# EasyEDA Pro project 第十五届蓝桥杯EDA赛项模拟试题一（嘉立创EDA提供）.eprj

# Schematic Schematic1
Create Date: 2024-01-25; Page Name: P1; Project Name: 第十五届蓝桥杯EDA赛项模拟试题一（嘉立创EDA提供）; Schematic Name: Schematic1; Update Date: 2024-01-25; Company: 深圳嘉立创科技集团股份有限公司; Drawed: 嘉立创EDA; Page Size: A4; Part Number: JLC-PCB-002; Reviewed: 嘉立创EDA; Version: V1.0
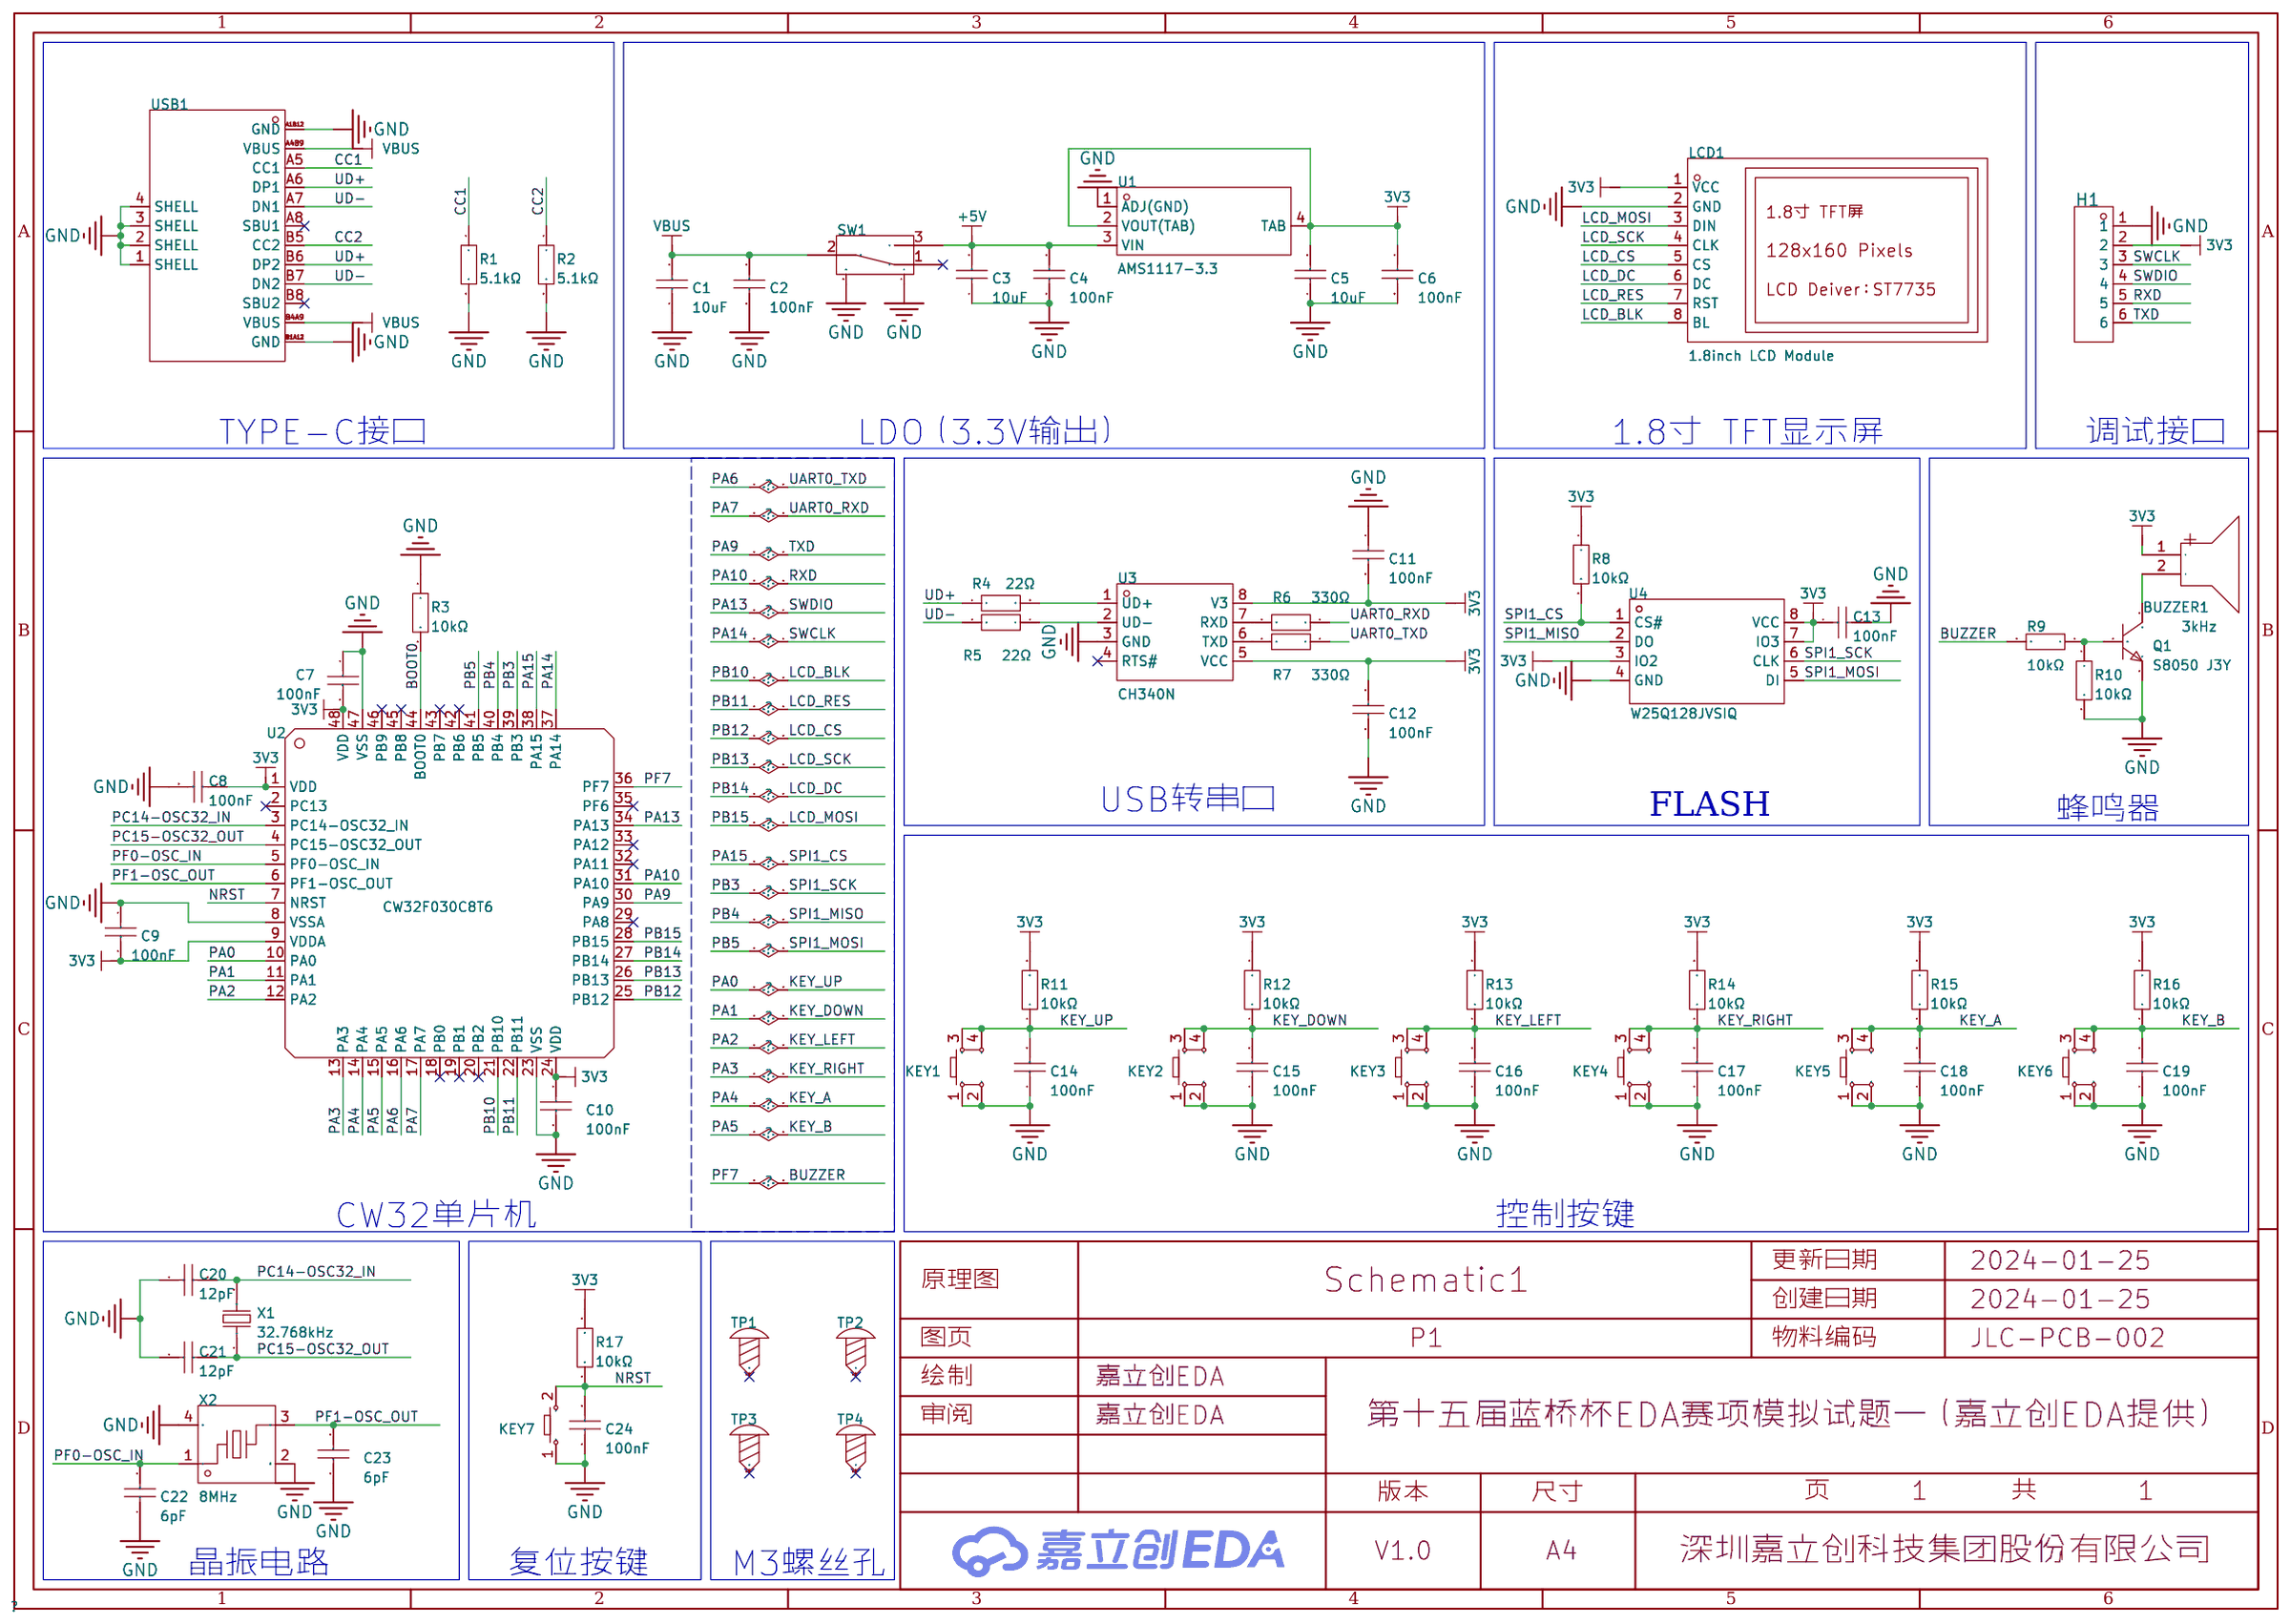
[diagram p0: schematic sheet]

## Parts
BUZZER1  3kHz  [BUZ-TH_BD9.0-P5.00-D0.6-FD]
C1  10uF  [C0805]
C2  100nF  [C0805]
C3  10uF  [C0805]
C4  100nF  [C0805]
C5  10uF  [C0805]
C6  100nF  [C0805]
C7  100nF  [C0805]
C8  100nF  [C0805]
C9  100nF  [C0805]
C10  100nF  [C0805]
C11  100nF  [C0805]
C12  100nF  [C0805]
C13  100nF  [C0805]
C14  100nF  [C0805]
C15  100nF  [C0805]
C16  100nF  [C0805]
C17  100nF  [C0805]
C18  100nF  [C0805]
C19  100nF  [C0805]
C20  12pF  [C0805]
C21  12pF  [C0805]
C22  6pF  [C0805]
C23  6pF  [C0805]
C24  100nF  [C0805]
H1  PZ254V-11-06P  [HDR-TH_6P-P2.54-V-M]
KEY1  -  [SW-SMD_4P-L6.0-W6.0-P4.50-LS9.0-2]
KEY2  -  [SW-SMD_4P-L6.0-W6.0-P4.50-LS9.0-2]
KEY3  -  [SW-SMD_4P-L6.0-W6.0-P4.50-LS9.0-2]
KEY4  -  [SW-SMD_4P-L6.0-W6.0-P4.50-LS9.0-2]
KEY5  -  [SW-SMD_4P-L6.0-W6.0-P4.50-LS9.0-2]
KEY6  -  [SW-SMD_4P-L6.0-W6.0-P4.50-LS9.0-2]
KEY7  -  [Key_SMD_3.6x6.1x2.5]
LCD1  1.8inch LCD Module  [LCD-TH_L56.5-W34.0_1-8INCH-LCD-MODULE]
Q1  S8050 J3Y  [SOT-23-3_L3.0-W1.7-P0.95-LS2.9-BR]
R1  5.1kΩ  [R0805]
R2  5.1kΩ  [R0805]
R3  10kΩ  [R0805]
R4  22Ω  [R0805]
R5  22Ω  [R0805]
R6  330Ω  [R0805]
R7  330Ω  [R0805]
R8  10kΩ  [R0805]
R9  10kΩ  [R0805]
R10  10kΩ  [R0805]
R11  10kΩ  [R0805]
R12  10kΩ  [R0805]
R13  10kΩ  [R0805]
R14  10kΩ  [R0805]
R15  10kΩ  [R0805]
R16  10kΩ  [R0805]
R17  10kΩ  [R0805]
SW1  SK-12E12-G5  [SW-TH_SK-12E12-G5]
TP1  -  [M3螺丝]
TP2  -  [M3螺丝]
TP3  -  [M3螺丝]
TP4  -  [M3螺丝]
U1  AMS1117-3.3  [SOT-223-4_L6.5-W3.5-P2.30-LS7.0-BR]
U2  CW32F030C8T6  [LQ-LQFP48]
U3  CH340N  [SOP-8_L4.9-W3.9-P1.27-LS6.0-BL]
U4  W25Q128JVSIQ  [SOIC-8_L5.3-W5.3-P1.27-LS8.0-BL]
USB1  TYPE-C 16PIN 3MD(385)  [USB-C-SMD_TYPE-C16PIN]
X1  32.768kHz  [FC-135R_L3.2-W1.5]
X2  8MHz  [OSC-SMD_4P-L3.2-W2.5-BL]

## Library data of the parts
BUZZER1 = HNB09A03: 驱动方式:有源(内含驱动线路);构造类型:电磁式;额定电压:3V;工作电压:1.5V~4.5V;消耗电流:30mA;频率:3kHz;声压(SPL):85dB@10cm;直径(φD):9mm;长度:-;宽度:-;高度:5.5mm;工作温度:-20℃~+70℃;; LCSC Part Name: 电磁式有源一体蜂鸣器HNB09A03; Supplier Part: C96102; Manufacturer: 华能; Supplier Footprint: 插件,D=9mm; Datasheet: https://atta.szlcsc.com/upload/public/pdf/source/20170522/1495448326172.pdf; Supplier: LCSC; Oscillator Circuit: 有源(内含驱动线路); Technology Type: 电磁式; Rated Voltage: 3V; Operating Voltage: 1.5V~4.5V; Current Consumption: 30mA; Sound Pressure Level (SPL): 85dB@10cm; Diameter (φD): 9mm; Height: 5.5mm; Operating Temperature: -20℃~+70℃
C1 C3 C5 = CL21A106KAYNNNE_C15850: 容值:10uF;精度:±10%;额定电压:25V;材质(温度系数):X5R;; LCSC Part Name: 10uF ±10% 25V; Supplier Part: C15850; Manufacturer: SAMSUNG(三星); Manufacturer Part: CL21A106KAYNNNE; Supplier Footprint: 0805; Datasheet: https://atta.szlcsc.com/upload/public/pdf/source/20160103/1457707679302.pdf; Supplier: LCSC; Tolerance: ±10%; Voltage Rated: 25V; Temperature Coefficient: X5R
C2 C4 C6-C19 C24 = CL21B104KBCNNNC: 容值:100nF;精度:±10%;额定电压:50V;材质(温度系数):X7R;; LCSC Part Name: 100nF ±10% 50V; Supplier Part: C1711; Manufacturer: SAMSUNG(三星); Supplier Footprint: 0805; Datasheet: https://atta.szlcsc.com/upload/public/pdf/source/20160218/1457707763339.pdf; Supplier: LCSC; Tolerance: ±10%; Voltage Rated: 50V; Temperature Coefficient: X7R
C20 C21 = 0805CG120J500NT: 容值:12pF;精度:±5%;额定电压:50V;材质(温度系数):C0G;; LCSC Part Name: 12pF ±5% 50V; Supplier Part: C1792; Manufacturer: FH(风华); Supplier Footprint: 0805; Datasheet: https://atta.szlcsc.com/upload/public/pdf/source/20200305/C486355_26A10D38EF8C2A5C37091D0039909270.pdf; Supplier: LCSC; Tolerance: ±5%; Voltage Rated: 50V; Temperature Coefficient: C0G
C22 C23 = 0805CG6R0C500NT: 容值:6pF;额定电压:50V;材质(温度系数):C0G;; LCSC Part Name: 6pF 50V ±0.25pF; Supplier Part: C67560; Manufacturer: FH(风华); Supplier Footprint: 0805; JLCPCB Part Class: 扩展库; Datasheet: https://atta.szlcsc.com/upload/public/pdf/source/20200305/C486355_26A10D38EF8C2A5C37091D0039909270.pdf; Supplier: LCSC; Voltage Rated: 50V; Temperature Coefficient: C0G
H1 = PZ254V-11-06P: 排数:单排;总PIN位数:6;间距:2.54mm;插针结构:1x6P;行距:-;安装类型:直插;圆针/方针:方针;额定电流:-;额定电压:-;配合针长度:6mm;塑高:2.5mm;端接针长度:3mm;触头材质:黄铜;触头镀层:-;工作温度范围:-40℃~+105℃;颜色:黑色;; LCSC Part Name: 2.54mm 1x6P 直插 方针; Supplier Part: C492405; Manufacturer: XFCN(兴飞); Supplier Footprint: 直插,P=2.54mm; JLCPCB Part Class: 扩展库; Supplier: LCSC; Number of Rows: 单排; Number of Pins: 6; Pitch: 2.54mm; Pin Structure: 1x6P; Mounting Type: 直插; Circluar Pins/Square Pins: 方针; Length of Mating Pin: 6mm; Insulation Height: 2.5mm; Length of End Connection Pin: 3mm; Contact Material: 黄铜; Operating Temperature Range: -40℃~+105℃; Color: 黑色
KEY1-KEY6 = Key_SMD_6x6x6.5: Supplier Footprint: SMD
KEY7 = Key_SMD_3.6x6.1x2.5: Supplier Footprint: SMD
LCD1 = 1.8inch LCD Module: 主控芯片:ST7735S;尺寸(inch):1.8;; LCSC Part Name: 树莓派 1.8寸LCD 迷你显示屏 扩展板 SPI接口 支持Arduino; Supplier Part: C359940; Manufacturer: Waveshare(微雪电子); Datasheet: https://atta.szlcsc.com/upload/public/pdf/source/20190107/C359940_B08D95A5D16FFF3D67403C4EC320696B.pdf; Supplier: LCSC; Main Control Chip: ST7735S; Size: 1.8
Q1 = S8050 J3Y_C2146: 晶体管类型:NPN;集射极击穿电压(Vceo):25V;集电极电流(Ic):500mA;功率(Pd):300mW;直流电流增益(hFE@Ic,Vce):200@50mA,1V;; LCSC Part Name: NPN 25V 500mA (200-350); Supplier Part: C2146; Manufacturer: CJ(江苏长电/长晶); Supplier Footprint: SOT-23; Datasheet: https://atta.szlcsc.com/upload/public/pdf/source/20140809/1457707209234.pdf; Supplier: LCSC; Transistor Type: NPN; Collector-Emitter Breakdown Voltage (Vceo): 25V; Collector Current (Ic): 500mA; Power Dissipation (Pd): 300mW; Collector Cut-Off Current (Icbo): 100nA; Collector-Emitter Saturation Voltage (VCE(sat)@Ic,Ib): 600mV@500mA,50mA; DC Current Gain (hFE@Ic,Vce): 200@50mA,1V; Transition Frequency (fT): 150MHz; Operating Temperature: +150℃@(Tj)
R1 R2 = 0805W8F5101T5E: 阻值:5.1kΩ;精度:±1%;功率:125mW;温度系数:±100ppm/℃;电阻类型:厚膜电阻;; LCSC Part Name: 5.1kΩ ±1% 125mW 厚膜电阻; Supplier Part: C27834; Manufacturer: UNI-ROYAL(厚声); Supplier Footprint: 0805; JLCPCB Part Class: 基础库; Datasheet: https://atta.szlcsc.com/upload/public/pdf/source/20200306/C422600_1E6D84923E4A46A82E41ADD87F860B5C.pdf; Supplier: LCSC; Tolerance: ±1%; Power(Watts): 125mW; Overload Voltage (Max): 150V; Temperature Coefficient: ±100ppm/℃; Type: 厚膜电阻; Operating Temperature Range: -55℃~+155℃
R3 R8-R17 = 0805W8F1002T5E_C17414: 阻值:10kΩ;精度:±1%;功率:125mW;温度系数:±100ppm/℃;电阻类型:厚膜电阻;; LCSC Part Name: 10kΩ ±1% 125mW 厚膜电阻; Supplier Part: C17414; Manufacturer: UNI-ROYAL(厚声); Manufacturer Part: 0805W8F1002T5E; Supplier Footprint: 0805; Datasheet: https://atta.szlcsc.com/upload/public/pdf/source/20200306/C422600_1E6D84923E4A46A82E41ADD87F860B5C.pdf; Supplier: LCSC; Tolerance: ±1%; Power(Watts): 125mW; Overload Voltage (Max): 150V; Temperature Coefficient: ±100ppm/℃; Type: 厚膜电阻; Operating Temperature Range: -55℃~+155℃
R4 R5 = 0805W8F220JT5E: 阻值:22Ω;精度:±1%;功率:125mW;温度系数:±100ppm/℃;电阻类型:厚膜电阻;; LCSC Part Name: 22Ω ±1% 125mW 厚膜电阻; Supplier Part: C17561; Manufacturer: UNI-ROYAL(厚声); Supplier Footprint: 0805; JLCPCB Part Class: 基础库; Datasheet: https://atta.szlcsc.com/upload/public/pdf/source/20200306/C422600_1E6D84923E4A46A82E41ADD87F860B5C.pdf; Supplier: LCSC; Tolerance: ±1%; Power(Watts): 125mW; Overload Voltage (Max): 150V; Temperature Coefficient: ±100ppm/℃; Type: 厚膜电阻; Operating Temperature Range: -55℃~+155℃
R6 R7 = 0805W8F3300T5E: 阻值:330Ω;精度:±1%;功率:125mW;温度系数:±100ppm/℃;电阻类型:厚膜电阻;; LCSC Part Name: 330Ω ±1% 125mW 厚膜电阻; Supplier Part: C17630; Manufacturer: UNI-ROYAL(厚声); Supplier Footprint: 0805; JLCPCB Part Class: 基础库; Datasheet: https://atta.szlcsc.com/upload/public/pdf/source/20200306/C422600_1E6D84923E4A46A82E41ADD87F860B5C.pdf; Supplier: LCSC; Tolerance: ±1%; Power(Watts): 125mW; Overload Voltage (Max): 150V; Temperature Coefficient: ±100ppm/℃; Type: 厚膜电阻; Operating Temperature Range: -55℃~+155℃
SW1 = SK-12E12-G5: 额定电流(DC):-;额定电压(DC):-;额定电流(AC):-;额定电压(AC):-;电路结构:单刀双掷;安装方式:卧插;机械寿命:5千次;; LCSC Part Name: 卧插双档 滑动开关; Supplier Part: C136720; Manufacturer: 韩国韩荣; Supplier Footprint: 插件; JLCPCB Part Class: 扩展库; Datasheet: https://atta.szlcsc.com/upload/public/pdf/source/20210810/880D64C2F8CCE477762EFCC00B7B7681.pdf; Supplier: LCSC; Circuit: 单刀双掷; Mounting Style: 卧插; Mechanical Life: 5千次; Actuator Style: 矩形柱状; Pin Style: PC引脚; Operating Temperature: -25℃~+70℃; Switch Height: 10.6mm
TP1-TP4 = M3螺丝: Supplier Footprint: 插件
U1 = AMS1117-3.3_C347222: 输出类型:固定;最大输入电压:18V;输出电压:3.3V;输出电流:1A;电源纹波抑制比(PSRR):60dB@(120Hz);输出极性:正;; LCSC Part Name: 输入18V 输出3.3V 1A; Supplier Part: C347222; Manufacturer: UMW(友台半导体); Supplier Footprint: SOT-223; JLCPCB Part Class: 扩展库; Datasheet: https://atta.szlcsc.com/upload/public/pdf/source/20231109/155D79A26D9DB04352555A58D5969DC8.pdf; Supplier: LCSC; Output Type: 固定; Maximum Input Voltage: 18V; Output Voltage: 3.3V; Output Current: 1A; Power Supply Rejection Ratio (PSRR): 60dB@(120Hz); Dropout Voltage: 1.3V@(1A); Output Polarity: 正; Number of Outputs: 1
U2 = CW32F030C8T6_C3019113: CPU内核:ARM-M系列;CPU最大主频:64MHz;程序存储容量:-;程序存储器类型:-;GPIO端口数量:39;工作电压范围:1.65V~5.5V;RAM总容量:8KB;; Supplier Part: C3019113; Manufacturer: CW(芯源); Supplier Footprint: LQFP-48(7x7); Datasheet: https://atta.szlcsc.com/upload/public/pdf/source/20220516/D60F5E1023A73FFF550D4A77416DDFBC.pdf; Supplier: LCSC; CPU Core: ARM-M系列; CPU Maximum Speed: 64MHz; GPIO Ports Number: 39; Operating Voltage Range: 1.65V~5.5V; RAM Size: 8KB; Operating Temperature Range: -40℃~+105℃; ADC (Bit): 12bit; 16Bit Timer: 8; UART/USART: 3; I2C: 2; SPI: 2; Internal Comparator: 有; Peripheral/Function: 片载温度传感器；DMA；看门狗；低电压检测；CRC校验; Watchdog: 有; Low-Voltage Detect: 有; Direct Memory Access: 有
U3 = CH340N: LCSC Part Name: USB转串口芯片 CH340; Supplier Part: C2977777; Manufacturer: WCH(南京沁恒); Supplier Footprint: SOP-8; JLCPCB Part Class: 扩展库; Datasheet: https://atta.szlcsc.com/upload/public/pdf/source/20230530/6E401E9554E9F5311886CC8B3F89B62E.pdf; Supplier: LCSC
U4 = W25Q128JVSIQ: 接口类型:-;存储容量:128Mbit;时钟频率(fc):-;; LCSC Part Name: W25Q128JVSIQ 编带; Supplier Part: C97521; Manufacturer: WINBOND(华邦); Supplier Footprint: SOP-8-208mil; JLCPCB Part Class: 基础库; Datasheet: https://atta.szlcsc.com/upload/public/pdf/source/20170316/1489627409956.pdf; Supplier: LCSC; Memory Size: 128Mbit
USB1 = TYPE-C 16PIN 3MD(385): 连接器类型:Type-C;标准:-;公母:母;端口数量:1;触点数量:16P;安装方式:卧贴;额定电流 - 电源:3A;工作温度范围:-40℃~+85℃;; LCSC Part Name: Type-C 母 卧贴; Supplier Part: C2858270; Manufacturer: SHOU HAN(首韩); Supplier Footprint: SMD; JLCPCB Part Class: Extended Part; Datasheet: https://atta.szlcsc.com/upload/public/pdf/source/20211123/39B17C16241EAC15C5E277BDA434118E.pdf; Supplier: LCSC; Connector Type: Type-C; Gender: 母; Number of Ports: 1; Number of Contacts: 16P; Mounting Style: 卧贴; Current Rating - Power (Max): 3A; Operating Temperature Range: -40℃~+85℃
X1 = Q13FC1350000400: 频率:32.768kHz;负载电容:12.5pF;频率公差:±20ppm;; LCSC Part Name: 32.768kHz ±20ppm 12.5pF; Supplier Part: C32346; Manufacturer: EPSON(爱普生); Supplier Footprint: SMD3215-2P; Datasheet: https://atta.szlcsc.com/upload/public/pdf/source/20190108/C32346_746D6B07EAF90824457A96480007685F.pdf; Supplier: LCSC; Crystal Type: 贴片无源晶振; Load Capacitance: 12.5pF; Equivalent Series Resistance (ESR): 70kΩ; Frequency Tolerance: ±20ppm; Operating Temperature: -40℃~+85℃
X2 = X32258MOB4SI: 晶振类型:贴片无源晶振;频率:8MHz;常温频差:±10ppm;负载电容:12pF;频率稳定度(全温):±30ppm;; LCSC Part Name: 8MHz ±10ppm 12pF; Supplier Part: C2682775; Manufacturer: YXC(扬兴晶振); Supplier Footprint: SMD3225-4P; JLCPCB Part Class: 扩展库; Datasheet: https://atta.szlcsc.com/upload/public/pdf/source/20210106/C2682774_0CD4FDA5D9DA3FBEEC23BD607A48E4B0.pdf; Supplier: LCSC; Crystal Type: 贴片无源晶振; Normal temperature Frequency Tolerance: ±10ppm; Load Capacitance: 12pF; Frequency Stability(Full temperature range): ±30ppm; Equivalent Series Resistance (ESR): 150Ω; Operating Temperature: -40℃~+85℃

## Nets
3V3: BUZZER1.1(+) C5.2 C6.1 C7.2 C8.1 C9.2 C10.1 C11.2 C12.1 C13.1 H1.2 LCD1.1(VCC) R8.1 R11.2 R12.2 R13.2 R14.2 R15.2 R16.2 R17.2 U1.2(VOUT(TAB)) U1.4(TAB) U2.1(VDD) U2.9(VDDA) U2.24(VDD) U2.48(VDD) U3.5(VCC) U3.8(V3) U4.3(IO2) U4.7(IO3) U4.8(VCC)
+5V: C3.2 C4.1 SW1.3 U1.3(VIN)
GND: C1.1 C2.2 C3.1 C4.2 C5.1 C6.2 C7.1 C8.2 C9.1 C10.2 C11.1 C12.2 C13.2 C14.1 C15.1 C16.1 C17.1 C18.1 C19.1 C20.1 C21.1 C22.1 C23.1 C24.1 H1.1 KEY1.1 KEY1.2 KEY2.1 KEY2.2 KEY3.1 KEY3.2 KEY4.1 KEY4.2 KEY5.1 KEY5.2 KEY6.1 KEY6.2 KEY7.1 LCD1.2(GND) Q1.2(E) R1.2 R2.2 R3.1 R10.2 SW1.4 SW1.5 U1.1(ADJ(GND)) U2.8(VSSA) U2.23(VSS) U2.47(VSS) U3.3(GND) U4.4(GND) USB1.1(SHELL) USB1.2(SHELL) USB1.3(SHELL) USB1.4(SHELL) USB1.A1B12(GND) USB1.B1A12(GND) X2.2(GND) X2.4(GND)
VBUS: C1.2 C2.1 SW1.2 USB1.A4B9(VBUS) USB1.B4A9(VBUS)
BOOT0: R3.2 U2.44(BOOT0)
BUZZER: R9.2 U2.36(PF7)
CC1: R1.1 USB1.A5(CC1)
CC2: R2.1 USB1.B5(CC2)
KEY_A: C18.2 KEY5.3 KEY5.4 R15.1 U2.14(PA4)
KEY_B: C19.2 KEY6.3 KEY6.4 R16.1 U2.15(PA5)
KEY_DOWN: C15.2 KEY2.3 KEY2.4 R12.1 U2.11(PA1)
KEY_LEFT: C16.2 KEY3.3 KEY3.4 R13.1 U2.12(PA2)
KEY_RIGHT: C17.2 KEY4.3 KEY4.4 R14.1 U2.13(PA3)
KEY_UP: C14.2 KEY1.3 KEY1.4 R11.1 U2.10(PA0)
LCD_BLK: LCD1.8(BL) U2.21(PB10)
LCD_CS: LCD1.5(CS) U2.25(PB12)
LCD_DC: LCD1.6(DC) U2.27(PB14)
LCD_MOSI: LCD1.3(DIN) U2.28(PB15)
LCD_RES: LCD1.7(RST) U2.22(PB11)
LCD_SCK: LCD1.4(CLK) U2.26(PB13)
NRST: C24.2 KEY7.2 R17.1 U2.7(NRST)
PA6: R7.1 U2.16(PA6)
PA7: R6.1 U2.17(PA7)
PA9: H1.6 U2.30(PA9)
PA10: H1.5 U2.31(PA10)
PA13: H1.4 U2.34(PA13)
PA14: H1.3 U2.37(PA14)
PA15: R8.2 U2.38(PA15) U4.1(CS#)
PB3: U2.39(PB3) U4.6(CLK)
PB4: U2.40(PB4) U4.2(DO)
PB5: U2.41(PB5) U4.5(DI)
PC14-OSC32_IN: C20.2 U2.3(PC14-OSC32_IN) X1.2
PC15-OSC32_OUT: C21.2 U2.4(PC15-OSC32_OUT) X1.1
PF0-OSC_IN: C22.2 U2.5(PF0-OSC_IN) X2.1
PF1-OSC_OUT: C23.2 U2.6(PF1-OSC_OUT) X2.3
UD+: R4.1 USB1.A6(DP1) USB1.B6(DP2)
UD-: R5.2 USB1.A7(DN1) USB1.B7(DN2)
$1N8057: Q1.1(B) R9.1 R10.1
$1N8058: BUZZER1.2(-) Q1.3(C)
$1N34792: R5.1 U3.2(UD-)
$1N34803: R4.2 U3.1(UD+)
$1N34816: R6.2 U3.7(RXD)
$1N34824: R7.2 U3.6(TXD)

Not connected (* = marked no-connect by the designer): SW1 1*; TP1 1*; TP2 1*; TP3 1*; TP4 1*; U2 2(PC13)* 18(PB0)* 19(PB1)* 20(PB2)* 29(PA8)* 32(PA11)* 33(PA12)* 35(PF6)* 42(PB6)* 43(PB7)* 45(PB8)* 46(PB9)*; U3 4(RTS#)*; USB1 A8(SBU1)* B8(SBU2)*

## Notes on the sheet
- TYPE-C接口
- LDO（3.3V输出）
- 1.8寸 TFT显示屏
- 调试接口
- USB转串口
- FLASH
- 蜂鸣器
- CW32单片机
- 控制按键
- 晶振电路
- 复位按键
- M3螺丝孔

# Board PCB1
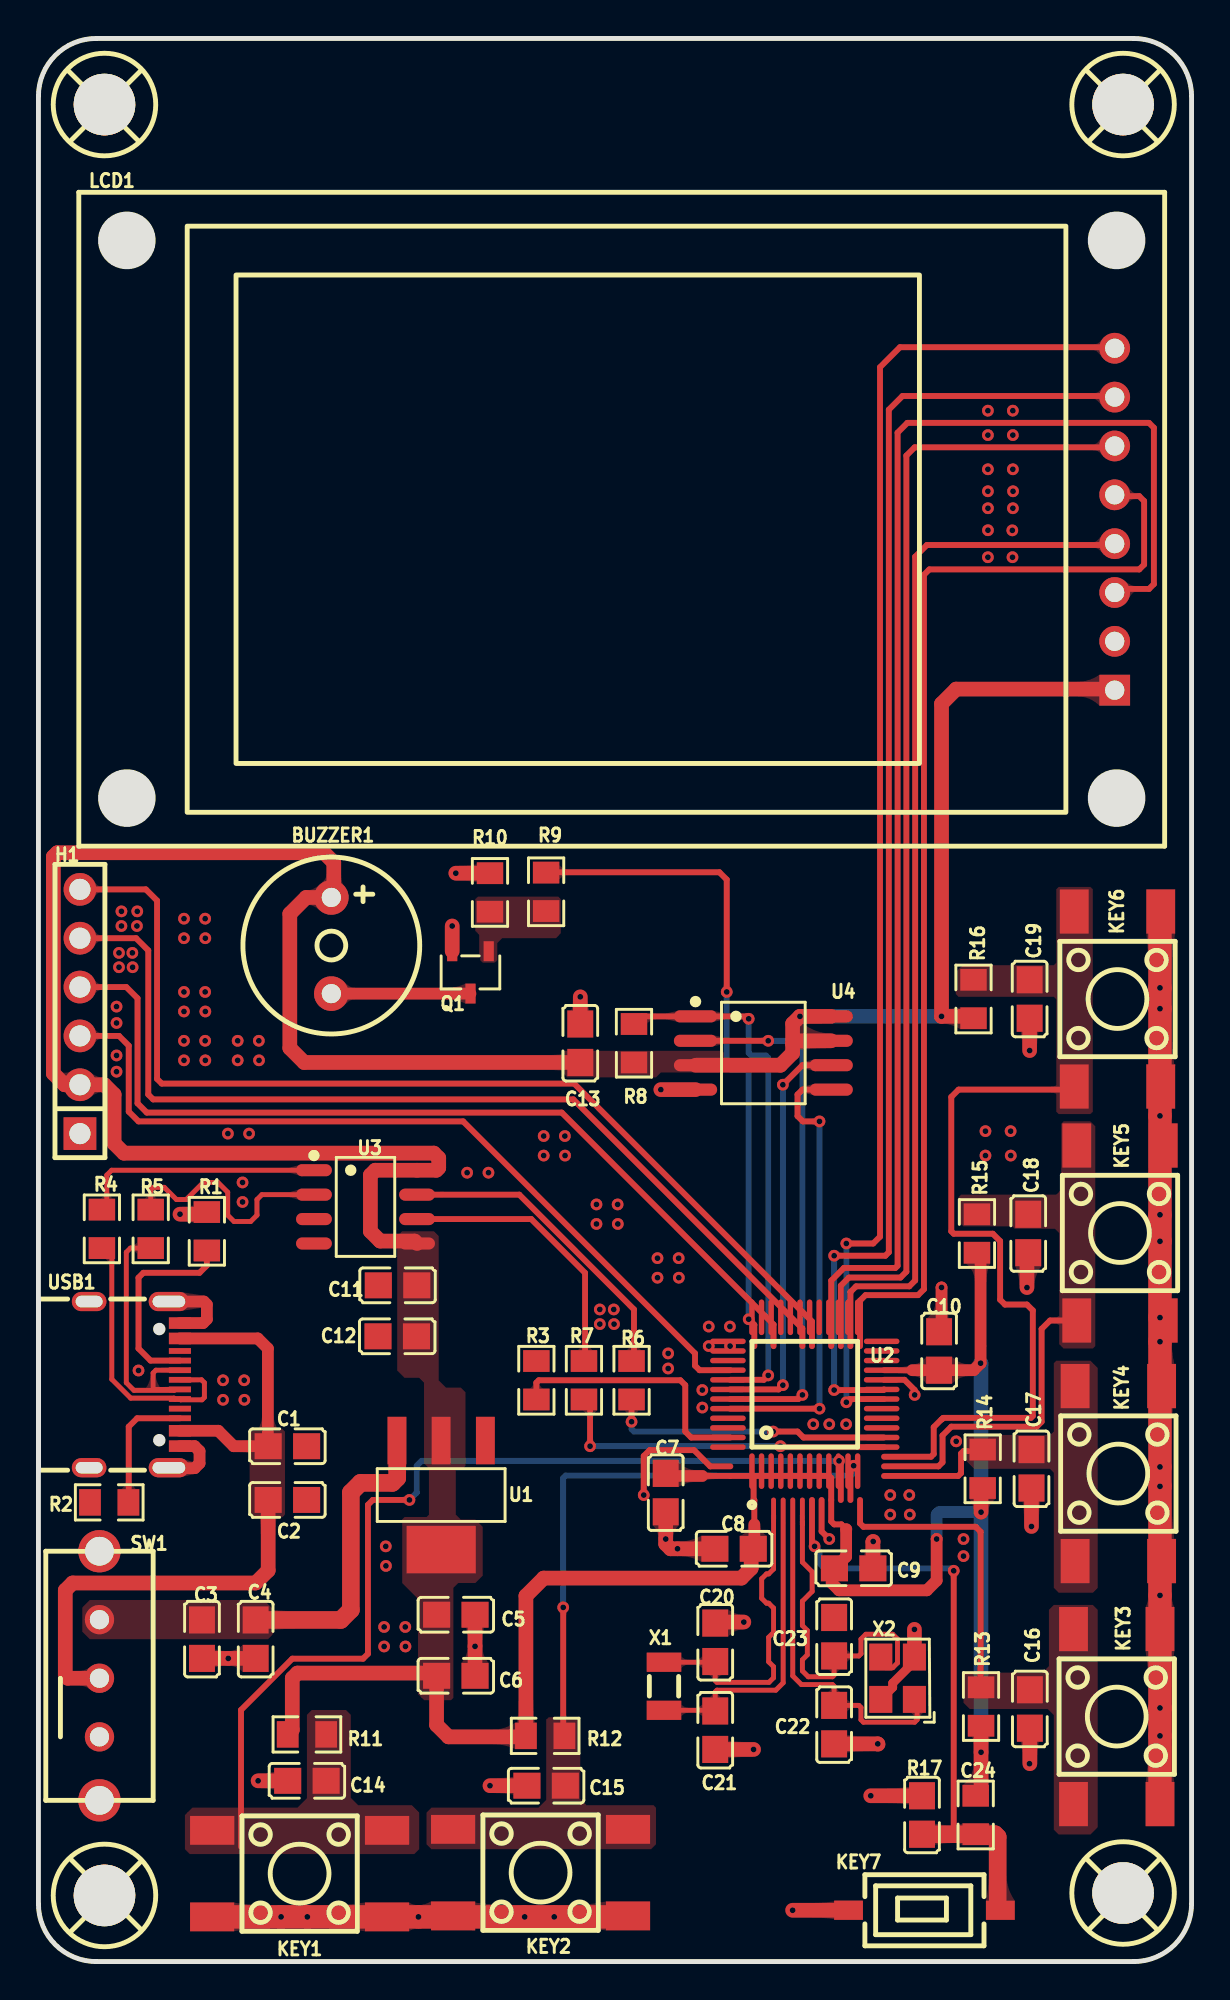
[diagram p1: board, top side]
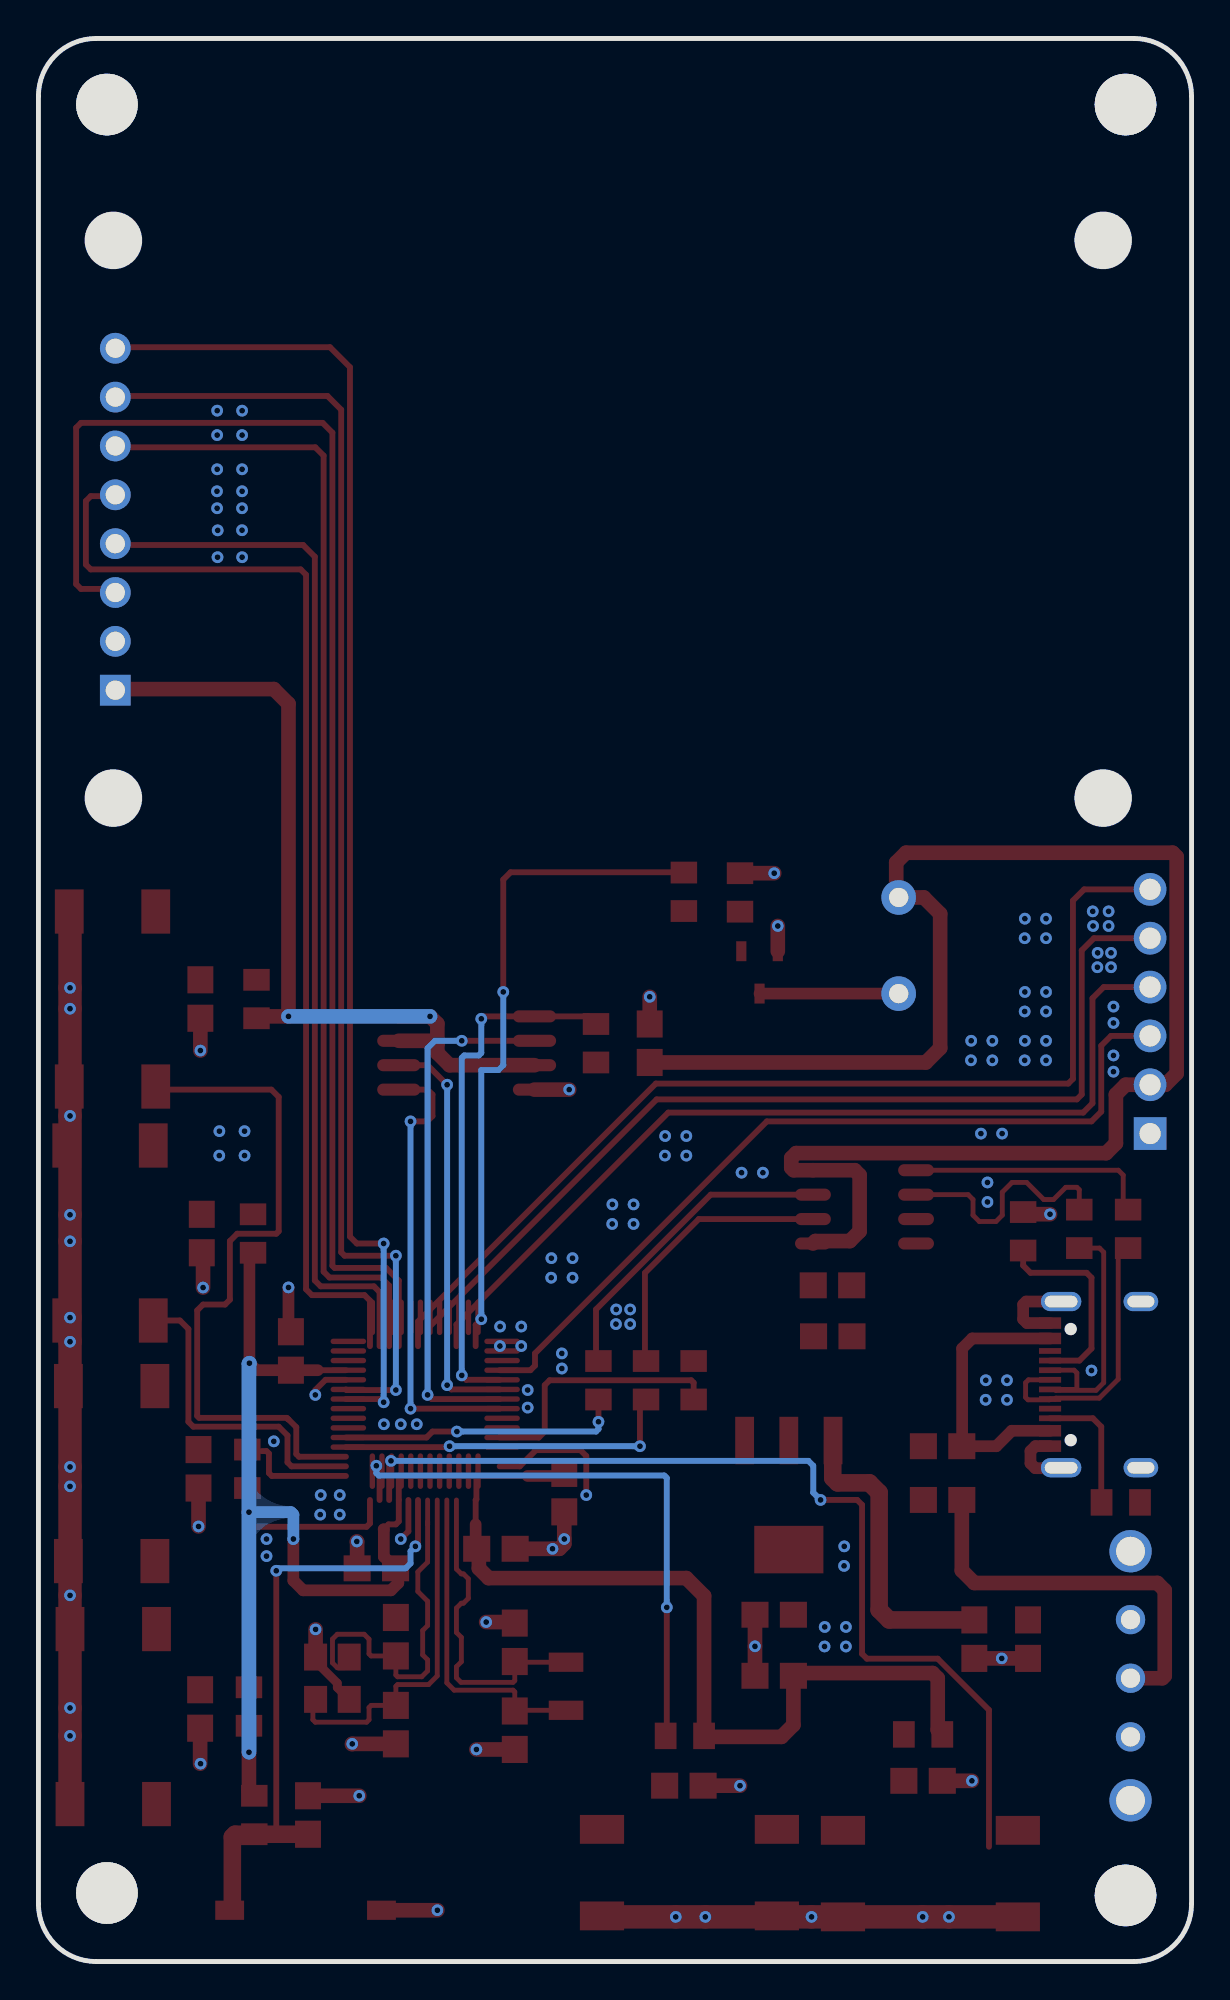
[diagram p2: board, bottom side, seen from below]

Outline 60 x 100 mm; copper layers: Top Layer, Bottom Layer. Coordinates in mm from the lower left corner of the outline.
Outline path: 0,97 0,3 arc(0.88,0.88) 3,0 57,0 arc(59.12,0.88) 60,3 60,97 arc(59.12,99.12) 57,100 3,100 arc(0.88,99.12) 0,97
Stack: Top Layer 0.035mm / Dielectric1 1.51mm FR4 er 4.5 / Bottom Layer 0.035mm

## Design rules (mm)
net PC15-OSC32_OUT: DP3
net PC14-OSC32_IN: DP3
net PF0-OSC_IN: DP4
net PF1-OSC_OUT: DP4
net $1N34803: DP2
net UD+: DP1
net UD-: DP1
net $1N34792: DP2
template: 自定义配置
spacing copperThickness1oz (default): track to track 0.152, other pairs 0.152 to 0.3
spacing copperThickness2oz: track to track 0.203, other pairs 0.152 to 0.3
track width copperThickness1oz (default): min 0.254, default 0.305, max 2.54
track width copperThickness2oz: min 0.203, default 0.254, max 2.54
track width PWR: min 0.254, default 0.762, max 2.54
differential pair differentialPair (default): width min 0.127, default 0.254, max 2.54; gap min 0.152, default 0.152
via viaSize (default): diameter min 0.5, default 0.559, max 10; hole min 0.254, default 0.254, max 6.299
net GND uses PWR
net 3V3 uses PWR
net +5V uses PWR
net VBUS uses PWR

## Placement (name value [footprint] x y rotation side)
BUZZER1  3kHz  [BUZ-TH_BD9.0-P5.00-D0.6-FD]  15.24 52.83 270 top
C1  10uF  [C0805]  12.95 26.8 180 top
C2  100nF  [C0805]  12.95 24 0 top
C3  10uF  [C0805]  8.51 16.76 90 top
C4  100nF  [C0805]  11.3 16.76 270 top
C5  10uF  [C0805]  21.72 18.03 180 top
C6  100nF  [C0805]  21.72 14.86 0 top
C7  100nF  [C0805]  32.64 24.38 90 top
C8  100nF  [C0805]  36.19 21.46 180 top
C9  100nF  [C0805]  42.42 20.45 180 top
C10  100nF  [C0805]  46.86 31.75 90 top
C11  100nF  [C0805]  18.69 35.16 0 top
C12  100nF  [C0805]  18.67 32.51 180 top
C13  100nF  [C0805]  28.19 47.75 90 top
C14  100nF  [C0805]  13.97 9.4 0 top
C15  100nF  [C0805]  26.42 9.14 0 top
C16  100nF  [C0805]  51.59 13.13 90 top
C17  100nF  [C0805]  51.67 25.62 90 top
C18  100nF  [C0805]  51.5 37.86 90 top
C19  100nF  [C0805]  51.57 50.05 90 top
C20  12pF  [C0805]  35.22 16.6 270 top
C21  12pF  [C0805]  35.22 12.03 90 top
C22  6pF  [C0805]  41.4 12.32 90 top
C23  6pF  [C0805]  41.4 16.89 270 top
C24  100nF  [C0805]  45.97 7.62 270 top
H1  PZ254V-11-06P  [HDR-TH_6P-P2.54-V-M]  2.16 49.4 90 top
KEY1  -  [SW-SMD_4P-L6.0-W6.0-P4.50-LS9.0-2]  13.59 4.57 180 top
KEY2  -  [SW-SMD_4P-L6.0-W6.0-P4.50-LS9.0-2]  26.13 4.62 180 top
KEY3  -  [SW-SMD_4P-L6.0-W6.0-P4.50-LS9.0-2]  56.11 12.74 270 top
KEY4  -  [SW-SMD_4P-L6.0-W6.0-P4.50-LS9.0-2]  56.19 25.37 270 top
KEY5  -  [SW-SMD_4P-L6.0-W6.0-P4.50-LS9.0-2]  56.28 37.88 270 top
KEY6  -  [SW-SMD_4P-L6.0-W6.0-P4.50-LS9.0-2]  56.15 50.05 270 top
KEY7  -  [Key_SMD_3.6x6.1x2.5]  46.1 2.67 0 top
LCD1  1.8inch LCD Module  [LCD-TH_L56.5-W34.0_1-8INCH-LCD-MODULE]  56 75 90 top
Q1  S8050 J3Y  [SOT-23-3_L3.0-W1.7-P0.95-LS2.9-BR]  22.48 51.44 90 top
R1  5.1kΩ  [R0805]  8.76 37.97 90 top
R2  5.1kΩ  [R0805]  3.68 23.88 180 top
R3  10kΩ  [R0805]  25.91 30.23 270 top
R4  22Ω  [R0805]  3.3 38.1 90 top
R5  22Ω  [R0805]  5.84 38.1 270 top
R6  330Ω  [R0805]  30.86 30.23 90 top
R7  330Ω  [R0805]  28.38 30.23 90 top
R8  10kΩ  [R0805]  30.99 47.75 90 top
R9  10kΩ  [R0805]  26.42 55.63 90 top
R10  10kΩ  [R0805]  23.5 55.59 90 top
R11  10kΩ  [R0805]  13.97 11.81 180 top
R12  10kΩ  [R0805]  26.37 11.74 180 top
R13  10kΩ  [R0805]  49.05 13.26 270 top
R14  10kΩ  [R0805]  49.13 25.62 270 top
R15  10kΩ  [R0805]  48.83 37.86 270 top
R16  10kΩ  [R0805]  48.65 50.05 270 top
R17  10kΩ  [R0805]  48.77 7.62 90 top
SW1  SK-12E12-G5  [SW-TH_SK-12E12-G5]  3.17 14.86 180 top
TP1  -  [M3螺丝]  3.5 3.5 90 top
TP2  -  [M3螺丝]  3.5 96.5 0 top
TP3  -  [M3螺丝]  56.5 96.5 0 top
TP4  -  [M3螺丝]  56.5 3.5 0 top
U1  AMS1117-3.3  [SOT-223-4_L6.5-W3.5-P2.30-LS7.0-BR]  20.96 24.26 90 top
U2  CW32F030C8T6  [LQ-LQFP48]  40 28 0 top
U3  CH340N  [SOP-8_L4.9-W3.9-P1.27-LS6.0-BL]  17.02 39.24 270 top
U4  W25Q128JVSIQ  [SOIC-8_L5.3-W5.3-P1.27-LS8.0-BL]  37.72 47.24 270 top
USB1  TYPE-C 16PIN 3MD(385)  [USB-C-SMD_TYPE-C16PIN]  5 30 270 top
X1  32.768kHz  [FC-135R_L3.2-W1.5]  32.55 14.31 90 top
X2  8MHz  [OSC-SMD_4P-L3.2-W2.5-BL]  44.7 14.73 90 top

## Footprints (pads in the part's own frame, mm; a bottom-side part is the same pattern mirrored in y, then rotated)
BUZ-TH_BD9.0-P5.00-D0.6-FD
  round 1.8 hole 1: 1(-2.5,0) 2(2.5,0)
C0805
  rect 1.41x1.35 smd: 1(-1,0) 2(1,0)
FC-135R_L3.2-W1.5
  rect 1x1.8 smd: 1(-1.25,0) 2(1.25,0)
HDR-TH_6P-P2.54-V-M
  rect 1.7x1.7 hole 1.1: 1(-6.35,0)
  round 1.7 hole 1.1: 2(-3.81,0) 3(-1.27,0) 4(1.27,0) 5(3.81,0) 6(6.35,0)
Key_SMD_3.6x6.1x2.5
  rect 1.501x1.001 smd: 1(-3.95,0) 2(3.95,0)
LCD-TH_L56.5-W34.0_1-8INCH-LCD-MODULE
  rect 1.6x1.6 hole 1: 1(-8.89,0)
  round 1.6 hole 1: 2(-6.35,0) 3(-3.81,0) 4(-1.27,0) 5(1.27,0) 6(3.81,0) 7(6.35,0) 8(8.89,0)
LQ-LQFP48
  oval 0.28x1.85 smd: 1(-2.875,-2.5) 2(-2.375,-2.5) 3(-1.875,-2.5) 4(-1.375,-2.5) 5(-0.875,-2.5) 6(-0.375,-2.5) 7(0.125,-2.5) 8(0.625,-2.5) 9(1.125,-2.5) 10(1.625,-2.5) 11(2.125,-2.5) 12(2.625,-2.5) 25(2.625,5.5) 26(2.125,5.5) 27(1.625,5.5) 28(1.125,5.5) 29(0.625,5.5) 30(0.125,5.5) 31(-0.375,5.5) 32(-0.875,5.5) 33(-1.375,5.5) 34(-1.875,5.5) 35(-2.375,5.5) 36(-2.875,5.5)
  oval 1.85x0.28 smd: 13(3.875,-1.25) 14(3.875,-0.75) 15(3.875,-0.25) 16(3.875,0.25) 17(3.875,0.75) 18(3.875,1.25) 19(3.875,1.75) 20(3.875,2.25) 21(3.875,2.75) 22(3.875,3.25) 23(3.875,3.75) 24(3.875,4.25) 37(-4.125,4.25) 38(-4.125,3.75) 39(-4.125,3.25) 40(-4.125,2.75) 41(-4.125,2.25) 42(-4.125,1.75) 43(-4.125,1.25) 44(-4.125,0.75) 45(-4.125,0.25) 46(-4.125,-0.25) 47(-4.125,-0.75) 48(-4.125,-1.25)
M3螺丝
  round 3.2 hole 3.2: 1(-0.064,0.064)
OSC-SMD_4P-L3.2-W2.5-BL
  rect 1.4x1.2 smd: 1(-1.1,-0.875) 2(1.1,-0.875) 3(1.1,0.875) 4(-1.1,0.875)
R0805
  rect 1.133x1.377 smd: 1(-1,0) 2(1,0)
SOIC-8_L5.3-W5.3-P1.27-LS8.0-BL
  oval 0.63x2.25 smd: 1(-1.905,-3.53) 2(-0.635,-3.53) 3(0.635,-3.53) 4(1.905,-3.53) 5(1.905,3.53) 6(0.635,3.53) 7(-0.635,3.53) 8(-1.905,3.53)
SOP-8_L4.9-W3.9-P1.27-LS6.0-BL
  oval 0.63x1.865 smd: 1(-1.905,-2.683) 2(-0.635,-2.683) 3(0.635,-2.683) 4(1.905,-2.683) 5(1.905,2.683) 6(0.635,2.683) 7(-0.635,2.683) 8(-1.905,2.683)
SOT-23-3_L3.0-W1.7-P0.95-LS2.9-BR
  rect 1.038x0.532 smd: 1(1.101,-0.95) 2(1.101,0.95) 3(-1.101,0)
SOT-223-4_L6.5-W3.5-P2.30-LS7.0-BR
  rect 2.47x0.98 smd: 1(2.835,-2.3) 2(2.835,0) 3(2.835,2.3)
  rect 2.47x3.6 smd: 4(-2.835,0)
SW-SMD_4P-L6.0-W6.0-P4.50-LS9.0-2
  rect 2.3x1.5 smd: 1(-4.55,2.25) 2(4.55,2.25) 3(-4.55,-2.25) 4(4.55,-2.25)
SW-TH_SK-12E12-G5
  round 1.524 hole 1: 1(0,3.175) 2(0,0.127) 3(0,-2.921)
  round 2.2 hole 1.5: 4(0,-6.477) 5(0,6.477)
USB-C-SMD_TYPE-C16PIN
  oval 1x2.1 hole 0.6x1.7: 1(-4.32,1.788) 2(4.32,1.788)
  oval 1x1.8 hole 0.6x1.4: 3(-4.32,-2.362) 4(4.32,-2.362)
  rect 0.6x1.15 smd: A1B12(-3.2,2.362) A4B9(-2.4,2.362) B1A12(3.2,2.362) B4A9(2.4,2.362)
  rect 0.3x1.15 smd: A5(-1.25,2.362) A6(-0.25,2.362) A7(0.25,2.362) A8(-1.75,2.362) B5(1.75,2.362) B6(0.75,2.362) B7(-0.75,2.362) B8(1.25,2.362)

## Nets
As in the schematic.

Pads without a net: SW1 1; TP1 1; TP2 1; TP3 1; TP4 1; U2 2 18 19 20 29 32 33 35 42 43 45 46; U3 4; USB1 A8 B8

## Via types
v1: diameter 0.61, hole 0.305, Top Layer to Bottom Layer, 170 vias

## Routing (per net, layer and track width the routed paths; a pad name or vN(x,y) marks a point on that pad's centre or on a via; arc(x,y) is an arc through that point)
3V3: length 236.8
  Top Layer w0.305: 37.25,22.73 37.25,24 37.21,24.04 37.21,25.15 37.11,25.25 ; 44,30.75 45.47,30.75 ; 34.54,25.25 37.11,25.25 ; 37.11,25.25 41.15,25.25 41.25,25.15 41.25,22.88 41.4,22.73 41.78,22.73 42.04,22.48
  Top Layer w0.61: C7.2 32.77,25.25 34.54,25.25 ; 45.47,30.75 C10.1 48.66,30.75 v1(49.02,31.12) 49.02,36.67 R15.2 ; 42.04,22.48 42.03,22.47 42.03,21.06 C9.2 41.28,20.3 41.28,19.69 41.66,19.3 46.23,19.3 46.74,19.81 v1(46.74,21.97) ; C8.1 37.25,21.52 37.25,22.73
  Top Layer w0.762: R16.2 48.56,49.15 v1(46.99,49.15) 46.99,65.41 47.75,66.17 55.94,66.17 LCD1.1 ; 39.24,47.73 39.24,47.24 38.61,46.61 U4.3 ; 39.24,47.73 39.4,47.88 U4.7 ; 39.24,47.73 39.24,48.77 v1(39.62,49.15) U4.8 ; U3.5 19.57,37.47 17.78,37.47 17.27,37.97 17.27,40.89 17.53,41.15 U3.8 20.7,41.15 20.83,41.28 20.83,41.78 20.57,42.04 4.44,42.04 3.94,42.55 3.94,45.08 3.43,45.59 H1.2 1.36,45.59 0.78,46.18 0.78,57.45 0.98,57.66 14.86,57.66 15.37,57.15 15.37,55.46 BUZZER1.1 13.93,55.33 13.08,54.48 13.08,47.5 13.83,46.75 C13.1 ; R17.2 49.05,8.9 v1(49.05,10.88) R13.2 ; v1(49.05,23.37) 49.05,24.54 R14.2 ; C8.1 37.08,21.35 37.08,20.45 36.58,19.94 26.29,19.94 25.37,19.02 R12.2 25.31,11.68 21.34,11.68 20.72,12.3 C6.1 ; 20,15 13.48,15 13.21,14.73 13.21,12.05 R11.2
  Bottom Layer w0.61: v1(49.05,23.37) 46.86,23.37 46.74,23.24 v1(46.74,21.97)
  Bottom Layer w0.762: v1(39.62,49.15) v1(46.99,49.15) ; v1(49.02,31.12) 49.05,31.09 v1(49.05,23.37) v1(49.05,10.88)
+5V: length 15.9
  Top Layer w0.914: C4.1 15.73,17.76 16.26,18.29 16.26,24.38 16.76,24.89 18.41,24.89 18.67,25.15 18.67,27.08 U1.3
GND: length 135.5
  Top Layer w0.305: v1(45.59,29.46) 45.59,29.72 45.06,30.25 44,30.25 ; 40.75,24 40.75,22.37 v1(41.15,21.97) ; v1(31.5,24.26) 31.5,26.29 31.8,26.59 34.11,26.59 34.96,25.75 36,25.75
  Top Layer w0.457: X2.2 45.58,15.61 44.45,14.48 44.45,14.25 X2.4
  Top Layer w0.61: USB1.B1A12 8.12,26.8 8.38,26.54 8.38,25.91 8.13,25.65 6.81,25.65 USB1.2 ; v1(46.99,35.05) 46.99,32.88 C10.2 ; USB1.A1B12 8.56,33.2 8.76,33.4 8.76,34.16 8.61,34.32 USB1.1
  Top Layer w0.762: C24.1 v1(43.31,8.62) ; v1(7.37,38.86) 8.65,38.86 R1.2 ; U4.4 v1(32.38,45.34) ; C6.2 v1(22.72,16.39) C5.1 ; C4.2 v1(9.88,15.76) C3.1 ; C16.1 51.59,10.29 ; X2.2 v1(45.58,17.27) ; C9.1 43.42,21.83 v1(43.43,21.84) ; C18.1 51.44,36.79 v1(51.44,35.05) ; C14.1 v1(11.43,9.4) ; C22.1 v1(43.67,11.32) 43.69,11.3 ; KEY7.1 v1(39.24,2.67) ; C21.1 v1(37.21,11.03) ; C7.1 v1(32.64,21.97) 32.64,21.72 32.89,21.46 v1(33.25,21.46) C8.2 ; C15.1 v1(23.5,9.14) ; R10.2 v1(21.72,56.59) ; C20.1 35.27,17.65 v1(36.7,17.65) ; C19.1 v1(51.57,47.37) ; 21.53,52.54 v1(21.53,53.85) ; C13.2 v1(28.19,50.17) ; C17.1 v1(51.67,22.62)
  Top Layer w1.219: 30.68,2.37 30.63,2.32 v1(26.84,2.32) v1(25.3,2.32) v1(19.77,2.32) KEY1.1 v1(13.99,2.32) v1(12.62,2.32) KEY1.2 ; KEY3.2 v1(58.36,11.73) v1(58.36,13.19) KEY3.1 v1(58.36,19.04) v1(58.36,24.71) v1(58.36,25.72) v1(58.36,32.23) v1(58.36,33.48) v1(58.36,37.45) v1(58.36,38.83) v1(58.36,43.97) v1(58.36,49.55) v1(58.36,50.63) 58.36,54.56 KEY6.1
  vias: v1(4.06,49.66) v1(4.06,48.8) v1(4.06,47.12) v1(4.06,46.27) v1(4.19,52.45) v1(4.19,51.7) v1(4.32,54.61) v1(4.32,53.85) v1(4.89,52.45) v1(4.9,51.7) v1(5.14,54.61) v1(5.12,53.85) v1(5.21,30.73) v1(7.57,54.23) v1(7.57,53.21) v1(7.57,50.42) v1(7.57,49.4) v1(7.57,47.88) v1(7.57,46.86) v1(8.67,54.23) v1(8.68,53.21) v1(8.67,50.42) v1(8.68,49.4) v1(8.67,47.88) v1(8.68,46.86) v1(9.6,30.23) v1(9.6,29.21) v1(9.86,43.05) v1(10.37,47.88) v1(10.37,46.86) v1(10.62,40.51) v1(10.62,39.5) v1(10.71,30.23) v1(10.72,29.21) v1(10.96,43.05) v1(11.47,47.88) v1(11.48,46.86) v1(17.99,17.4) v1(17.99,16.38) v1(18.07,21.59) v1(18.08,20.57) v1(19.09,17.4) v1(19.1,16.38) v1(22.3,41.02) v1(23.42,41.02) v1(26.29,42.93) v1(26.29,41.91) v1(27.39,42.93) v1(27.4,41.91) v1(29.04,39.37) v1(29.04,38.35) v1(29.21,33.91) v1(29.21,33.15) v1(29.94,33.91) v1(29.95,33.15) v1(30.14,39.37) v1(30.15,38.35) v1(32.21,36.58) v1(32.21,35.56) v1(32.77,31.62) v1(32.77,30.84) v1(33.31,36.58) v1(33.32,35.56) v1(34.54,29.72) v1(34.54,28.81) v1(34.88,33.02) v1(34.88,32) v1(35.98,33.02) v1(35.99,32) v1(40.32,27.94) v1(41.15,27.94) v1(42.03,27.94) v1(44.32,24.26) v1(44.32,23.24) v1(45.31,24.26) v1(45.34,23.24) v1(47.75,27.05) v1(48.13,21.97) v1(48.13,21.08) v1(49.28,43.18) v1(49.28,41.91) v1(49.4,80.64) v1(49.4,79.38) v1(49.4,77.6) v1(49.4,76.45) v1(49.41,75.57) v1(49.41,74.43) v1(49.4,73.03) v1(50.59,43.18) v1(50.59,41.91) v1(50.7,80.64) v1(50.7,79.38) v1(50.7,77.6) v1(50.71,76.45) v1(50.7,75.57) v1(50.67,74.42) v1(50.68,73.03) v1(51.57,10.29)
VBUS: length 35.7
  Top Layer w0.61: 11.94,26.81 11.94,31.88 11.41,32.4 USB1.A4B9 ; C1.2 10.16,26.8 9.36,27.6 USB1.B4A9
  Top Layer w0.762: SW1.2 1.52,14.73 1.4,14.86 1.4,19.3 1.78,19.69 11.3,19.69 11.95,20.34 C2.1
BOOT0: length 13.7
  Top Layer w0.305: R3.2 25.91,30.1 26.03,30.23 33.4,30.23 33.66,29.97 33.66,27.56 33.96,27.25 36,27.25
BUZZER: length 34.9
  Top Layer w0.305: R9.2 26.43,56.64 35.43,56.64 35.81,56.26 v1(35.81,50.42) ; 37.25,32 37.25,33.11 v1(36.96,33.4)
  Bottom Layer w0.305: v1(36.96,33.4) 36.96,46.36 36.07,46.36 35.81,46.61 v1(35.81,50.42)
CC1: length 10.7
  Top Layer w0.305: R1.1 8.76,36.19 8.38,35.81 5.46,35.81 5.21,35.56 5.21,31.88 5.83,31.25 USB1.A5
CC2: length 6.8
  Top Layer w0.305: USB1.B5 5.14,28.25 4.7,27.81 4.7,23.89 R2.1
KEY_A: length 16.8
  Top Layer w0.305: KEY5.4 52.64,33.33 52.2,32.89 52.2,28.07 51.94,27.81 47.5,27.81 47.04,27.36 47.04,25.96 46.83,25.75 44,25.75
KEY_B: length 36.3
  Top Layer w0.305: KEY6.4 53.74,45.34 47.88,45.34 47.5,44.96 47.5,37.97 47.62,37.85 49.66,37.85 50.04,37.47 50.04,34.42 50.29,34.16 51.44,34.16 51.74,33.86 51.74,28.37 51.64,28.27 47.07,28.27 47.01,28.19 46.99,28.19 46.58,27.79 46.58,26.39 46.44,26.25 44,26.25
KEY_DOWN: length 30.9
  Top Layer w0.305: v1(27.31,18.41) 27.31,11.8 R12.1 ; v1(42.42,25.78) 42.25,25.61 42.25,24
  Bottom Layer w0.305: v1(27.31,18.41) 27.31,25.15 27.43,25.27 42.29,25.27 42.42,25.4 v1(42.42,25.78)
KEY_LEFT: length 15.8
  Top Layer w0.305: R13.1 49.02,14.28 49.02,22.35 48.77,22.61 42.93,22.61 42.75,22.78 42.75,24
KEY_RIGHT: length 5.5
  Top Layer w0.305: 44,25.25 47.86,25.25 48.01,25.4 48.01,26.42 48.13,26.54 48.39,26.54
KEY_UP: length 51.3
  Top Layer w0.305: v1(19.3,24) 17.4,24 17.15,23.75 17.15,16 16.89,15.75 13.21,15.75 10.54,13.08 10.54,5.97 ; 41.75,24 41.75,26.16 41.66,26.07 v1(41.66,26.03)
  Bottom Layer w0.305: v1(19.3,24) 19.69,24.38 19.69,25.78 19.94,26.03 v1(41.66,26.03)
LCD_BLK: length 70.1
  Top Layer w0.305: v1(42.04,29.08) 42.2,29.25 44,29.25 ; v1(42.04,37.34) 43.43,37.34 43.79,37.69 43.79,82.91 44.83,83.95 55.94,83.95 LCD1.8
  Bottom Layer w0.305: v1(42.04,37.34) v1(42.04,29.08)
LCD_CS: length 59.7
  Top Layer w0.305: 42.75,32 42.75,34.37 43.04,34.65 45.77,34.65 46.08,34.96 46.08,72.11 46.35,72.39 57.28,72.39 57.53,72.64 57.53,75.95 57.28,76.2 56.07,76.2 LCD1.5
LCD_DC: length 60.3
  Top Layer w0.305: LCD1.6 55.93,78.74 45.59,78.74 45.16,78.31 45.16,35.87 44.86,35.57 42.17,35.57 41.75,35.15 41.75,32
LCD_MOSI: length 74.5
  Top Layer w0.305: LCD1.3 56.18,71.37 57.78,71.37 58.04,71.63 58.04,79.76 57.78,80.01 45.21,80.01 44.7,79.5 44.7,36.18 44.59,36.07 41.91,36.07 41.25,35.41 41.25,32
LCD_RES: length 68.4
  Top Layer w0.305: LCD1.7 55.94,81.41 44.96,81.41 44.25,80.7 44.25,36.88 44.07,36.7 v1(41.4,36.7) ; v1(41.4,29.72) 43.97,29.72 44,29.75
  Bottom Layer w0.305: v1(41.4,36.7) v1(41.4,29.72)
LCD_SCK: length 54.7
  Top Layer w0.305: 42.25,32 42.25,34.82 42.54,35.11 45.31,35.11 45.62,35.42 45.62,73.05 46.23,73.66 55.93,73.66 LCD1.4
NRST: length 32.2
  Top Layer w0.305: v1(47.62,20.32) 47.62,6.6 ; 40.25,24 40.25,21.73 v1(40.39,21.59)
  Top Layer w0.914: C24.2 R17.1 49.77,6.62 49.91,6.48 49.91,2.81 KEY7.2
  Bottom Layer w0.305: v1(40.39,21.59) 40.64,21.34 40.64,20.7 40.89,20.45 47.5,20.45 v1(47.62,20.32)
PA6: length 17.9
  Top Layer w0.305: v1(38.61,26.8) 38.66,26.75 44,26.75 ; v1(28.7,26.8) 28.7,28.91 R7.1
  Bottom Layer w0.305: v1(38.61,26.8) v1(28.7,26.8)
PA7: length 14.9
  Top Layer w0.305: 44,27.25 39.81,27.25 39.5,27.56 v1(38.23,27.56) ; R6.1 v1(30.86,28.07)
  Bottom Layer w0.305: v1(38.23,27.56) 30.99,27.56 30.86,27.69 v1(30.86,28.07)
PA9: length 54.1
  Top Layer w0.305: 40.25,32 40.25,33.28 39.62,33.91 39.62,33.91 27.87,45.65 6.42,45.65 6.17,45.9 6.17,55.17 5.59,55.75 H1.6
PA10: length 51.3
  Top Layer w0.305: 2.16,53.21 5.08,53.21 5.72,52.58 5.72,45.08 5.97,44.83 27.83,44.83 39.75,32.91 39.75,32
PA13: length 47.7
  Top Layer w0.305: H1.4 4.57,50.67 5.16,50.09 5.16,44.63 5.64,44.14 27.23,44.14 38.25,33.12 38.25,32
PA14: length 43.4
  Top Layer w0.305: 2.16,48.13 4.19,48.13 4.7,47.62 4.7,44.2 5.21,43.69 22.1,43.69 34.16,31.62 34.16,30.99 34.4,30.75 36,30.75
PA15: length 27.7
  Top Layer w0.305: v1(36.96,49.02) 36.83,49.15 U4.1 31.38,49.15 R8.2 ; 36,30.25 37.74,30.25 v1(37.97,30.48)
  Bottom Layer w0.305: v1(36.96,49.02) 36.96,47.24 37.08,47.12 37.85,47.12 37.97,46.99 v1(37.97,30.48)
PB3: length 21.4
  Top Layer w0.305: 36,29.75 38.51,29.75 v1(38.74,29.97) ; v1(38.74,45.59) 39.75,46.61 U4.6
  Bottom Layer w0.305: v1(38.74,29.97) v1(38.74,45.59)
PB4: length 27.6
  Top Layer w0.305: 36,29.25 39.54,29.25 v1(39.75,29.46) ; v1(37.97,47.88) U4.2
  Bottom Layer w0.305: v1(39.75,29.46) 39.75,47.5 39.37,47.88 v1(37.97,47.88)
PB5: length 23.8
  Top Layer w0.305: v1(40.64,43.69) 39.77,43.69 39.5,43.96 39.5,45.08 39.75,45.34 U4.5 ; 36,28.75 v1(40.64,28.75)
  Bottom Layer w0.305: v1(40.64,28.75) v1(40.64,43.69)
PC14-OSC32_IN: length 16.9
  Top Layer w0.254: 38.25,24 38.25,20.41 38,20.16 37.89,20.16 37.63,19.9 37.63,18.89 37.89,18.63 38,18.63 38.25,18.38 38.25,17.11 37.99,16.86 37.99,15.59 38.25,15.33 38.25,14.75 38.01,14.52 35.31,14.52 35.22,14.61 C20.2 35.18,15.56 X1.2
PC15-OSC32_OUT: length 16.9
  Top Layer w0.254: X1.1 35.18,13.06 C21.2 35.22,14.02 35.31,14.11 38.37,14.11 38.75,14.49 38.75,24
PF0-OSC_IN: length 18.7
  Top Layer w0.254: 39.25,24 39.25,14.85 39.7,14.4 41.31,14.4 41.4,14.31 C22.2 42.69,13.32 42.8,13.21 42.8,12.57 42.93,12.45 45.59,12.45 45.72,12.57 45.72,13.49 X2.1
PF1-OSC_OUT: length 18.6
  Top Layer w0.254: 39.75,24 39.75,22.86 39.75,22.86 39.75,22.73 39.75,22.73 39.75,20.77 40.26,20.26 40.26,19.25 39.75,18.74 39.75,17.47 40.01,17.21 40.01,15.95 39.75,15.69 39.75,15.11 40.06,14.81 41.31,14.81 41.4,14.9 C23.2 42.69,15.89 42.8,16 42.8,16.76 43.05,17.02 44.45,17.02 44.7,16.77 44.7,15.53 44.45,15.28 44.07,15.28
UD+: length 14.7
  Top Layer w0.254: USB1.A6 8.49,30.25 8.64,30.1 8.64,29.34 8.51,29.21 7.4,29.21 USB1.B6 7.11,29.25 7.06,29.3 4.8,29.3 3.82,30.28 3.82,37.01 3.73,37.1 R4.1
UD-: length 14.8
  Top Layer w0.254: 7.57,29.75 USB1.A7 7.11,29.75 ; 7.11,29.75 7.06,29.7 4.97,29.7 4.57,30.1 4.57,36.88 4.79,37.1 R5.2 ; 7.11,29.75 5.97,29.75 5.97,30.61 6.11,30.75 USB1.B7
$1N8058: length 7.2
  Top Layer w0.61: BUZZER1.2 22.48,50.33
$1N34792: length 12.8
  Top Layer w0.254: R5.1 5.84,40.13 5.97,40.26 6.55,40.26 7.18,39.62 7.69,39.62 8.58,40.51 9.34,40.51 9.85,40 9.85,38.81 10.18,38.48 11.04,38.48 11.37,38.81 11.37,39.62 11.63,39.88 U3.2
$1N34803: length 12.8
  Top Layer w0.254: U3.1 3.81,41.15 3.56,40.89 3.56,39.35 R4.2
$1N34816: length 16.5
  Top Layer w0.305: R6.2 30.99,31.35 30.99,33.91 25.02,39.88 U3.7
$1N34824: length 14.5
  Top Layer w0.305: R7.2 28.44,31.28 28.44,35.81 25.64,38.61 U3.6

## Copper pours and planes (outline as drawn; the poured copper is in the pictures)
3V3 on Top Layer: 18.92,28.7 23.11,28.7 23.11,13.59 18.92,13.59
3V3 on Top Layer: 27.29,47.36 35.69,47.36 35.69,45.97 27.29,45.97
3V3 on Top Layer: 18.67,37.97 22.22,37.97 22.22,25.65 18.67,25.65
+5V on Top Layer: 2.29,18.8 12.21,18.8 12.21,16.76 2.29,16.76
GND on Top Layer: -1.65,100.71 60.58,100.71 60.58,-0.25 -1.65,-0.25
GND on Bottom Layer: -1.65,100.71 60.58,100.71 60.58,-0.25 -1.65,-0.25
VBUS on Top Layer: 10.99,27.7 12.83,27.7 12.83,23.11 10.99,23.11
KEY_A on Top Layer: 47.88,43.69 54.99,43.69 54.99,31.88 47.88,31.88
KEY_B on Top Layer: 47.74,55.88 54.86,55.88 54.86,44.07 47.74,44.07
KEY_DOWN on Top Layer: 20.19,12.7 32.13,12.7 32.13,5.84 20.19,5.84
KEY_LEFT on Top Layer: 48.13,18.54 55.12,18.54 55.12,6.6 48.13,6.6
KEY_RIGHT on Top Layer: 48.21,31.24 55.12,31.24 55.12,19.18 48.21,19.18
KEY_UP on Top Layer: 7.62,13.08 19.81,13.08 19.81,5.59 7.62,5.59
$1N8057 on Top Layer: 22.73,55.37 27.18,55.37 27.18,51.94 22.73,51.94

Small or netless copper shapes (teardrops, artwork), in the pictures only: 167 on Top Layer, 23 on Bottom Layer
